# Altium schematic sheet wunfly.SchDoc
size A2
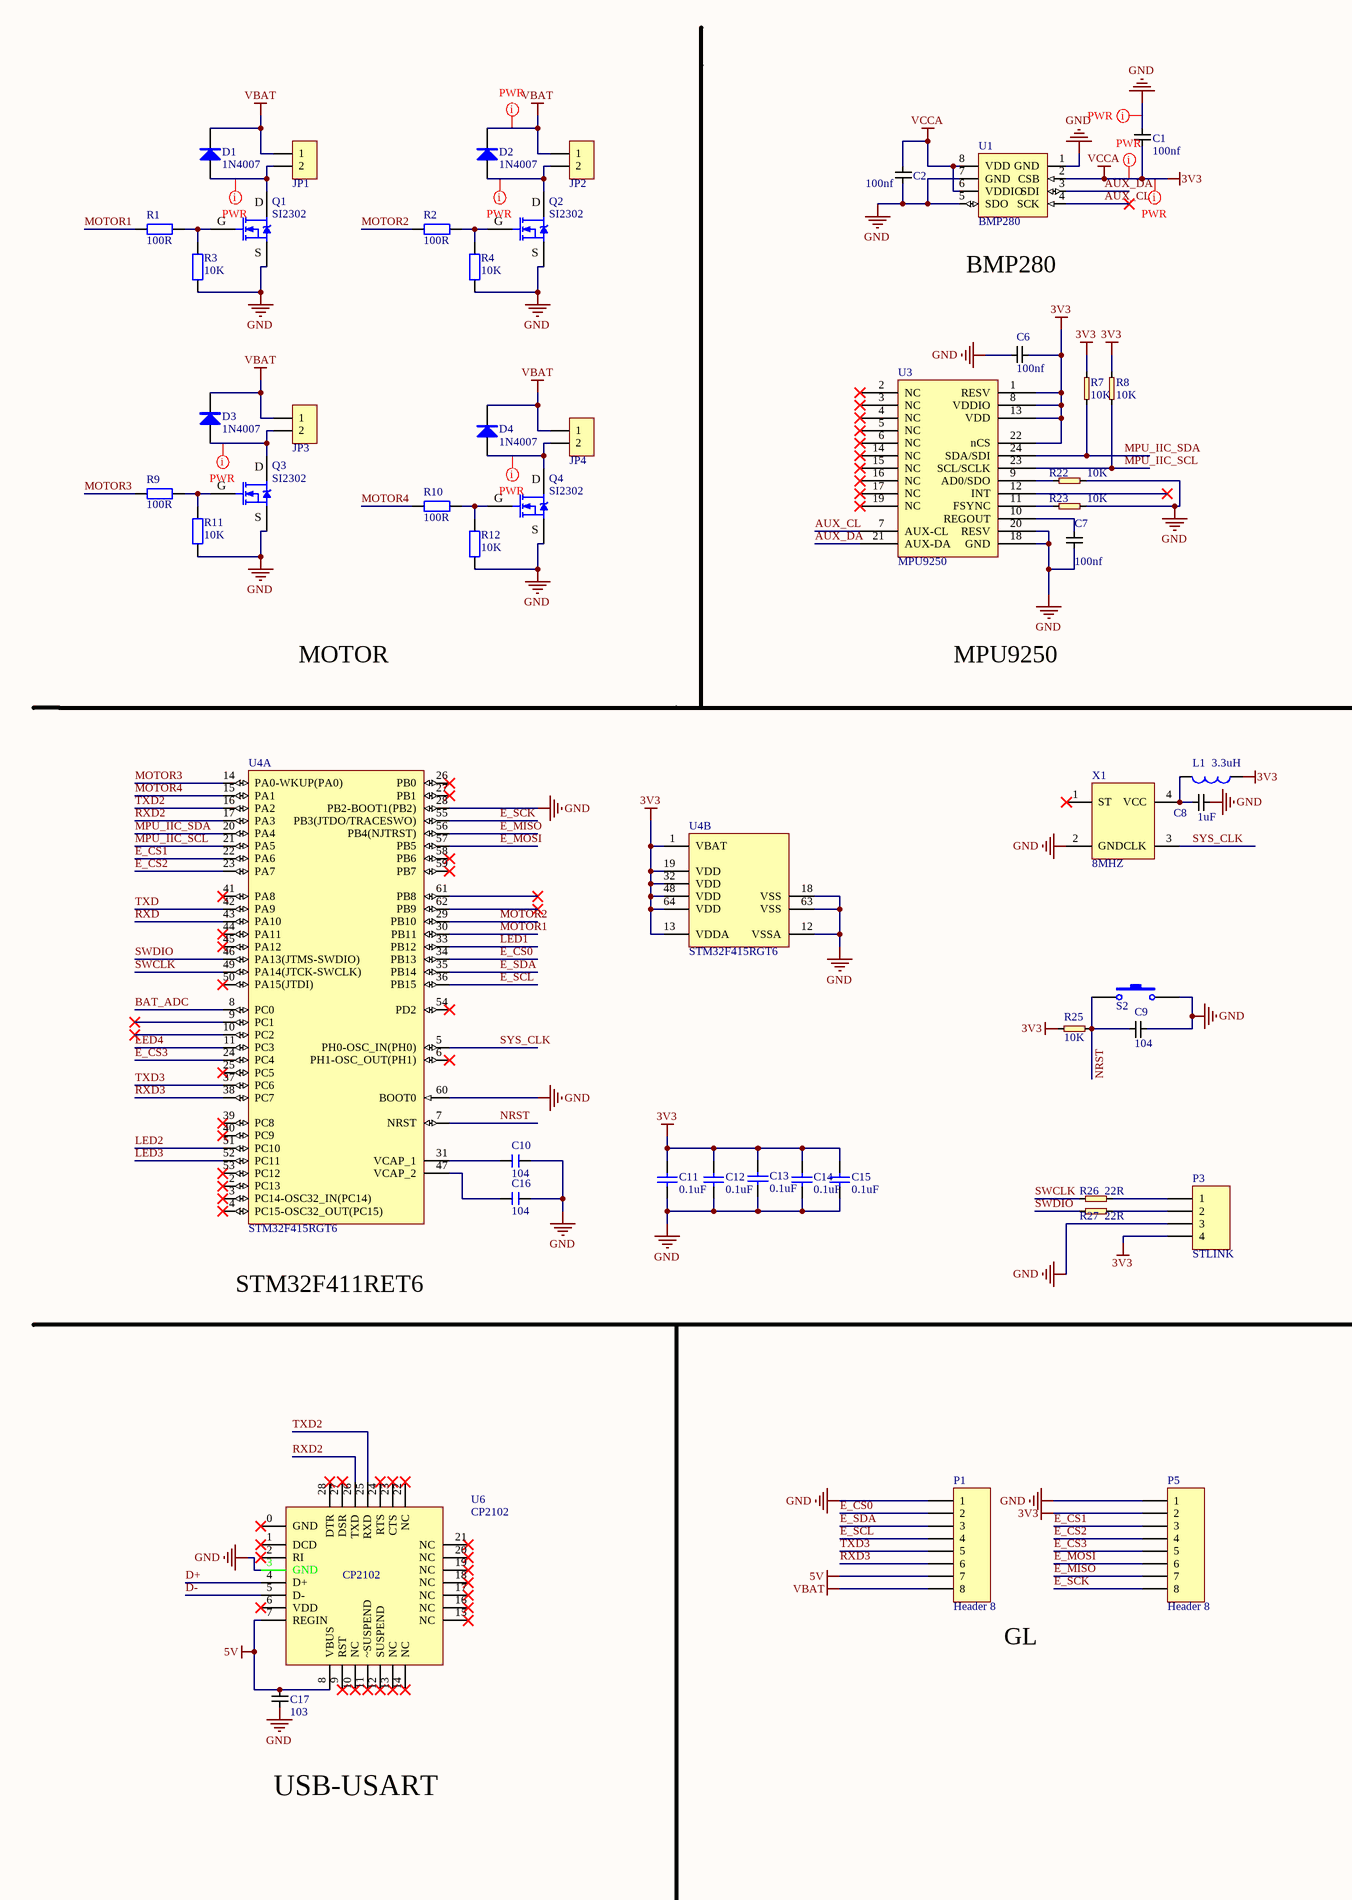
[diagram p0: wunfly.SchDoc, left]
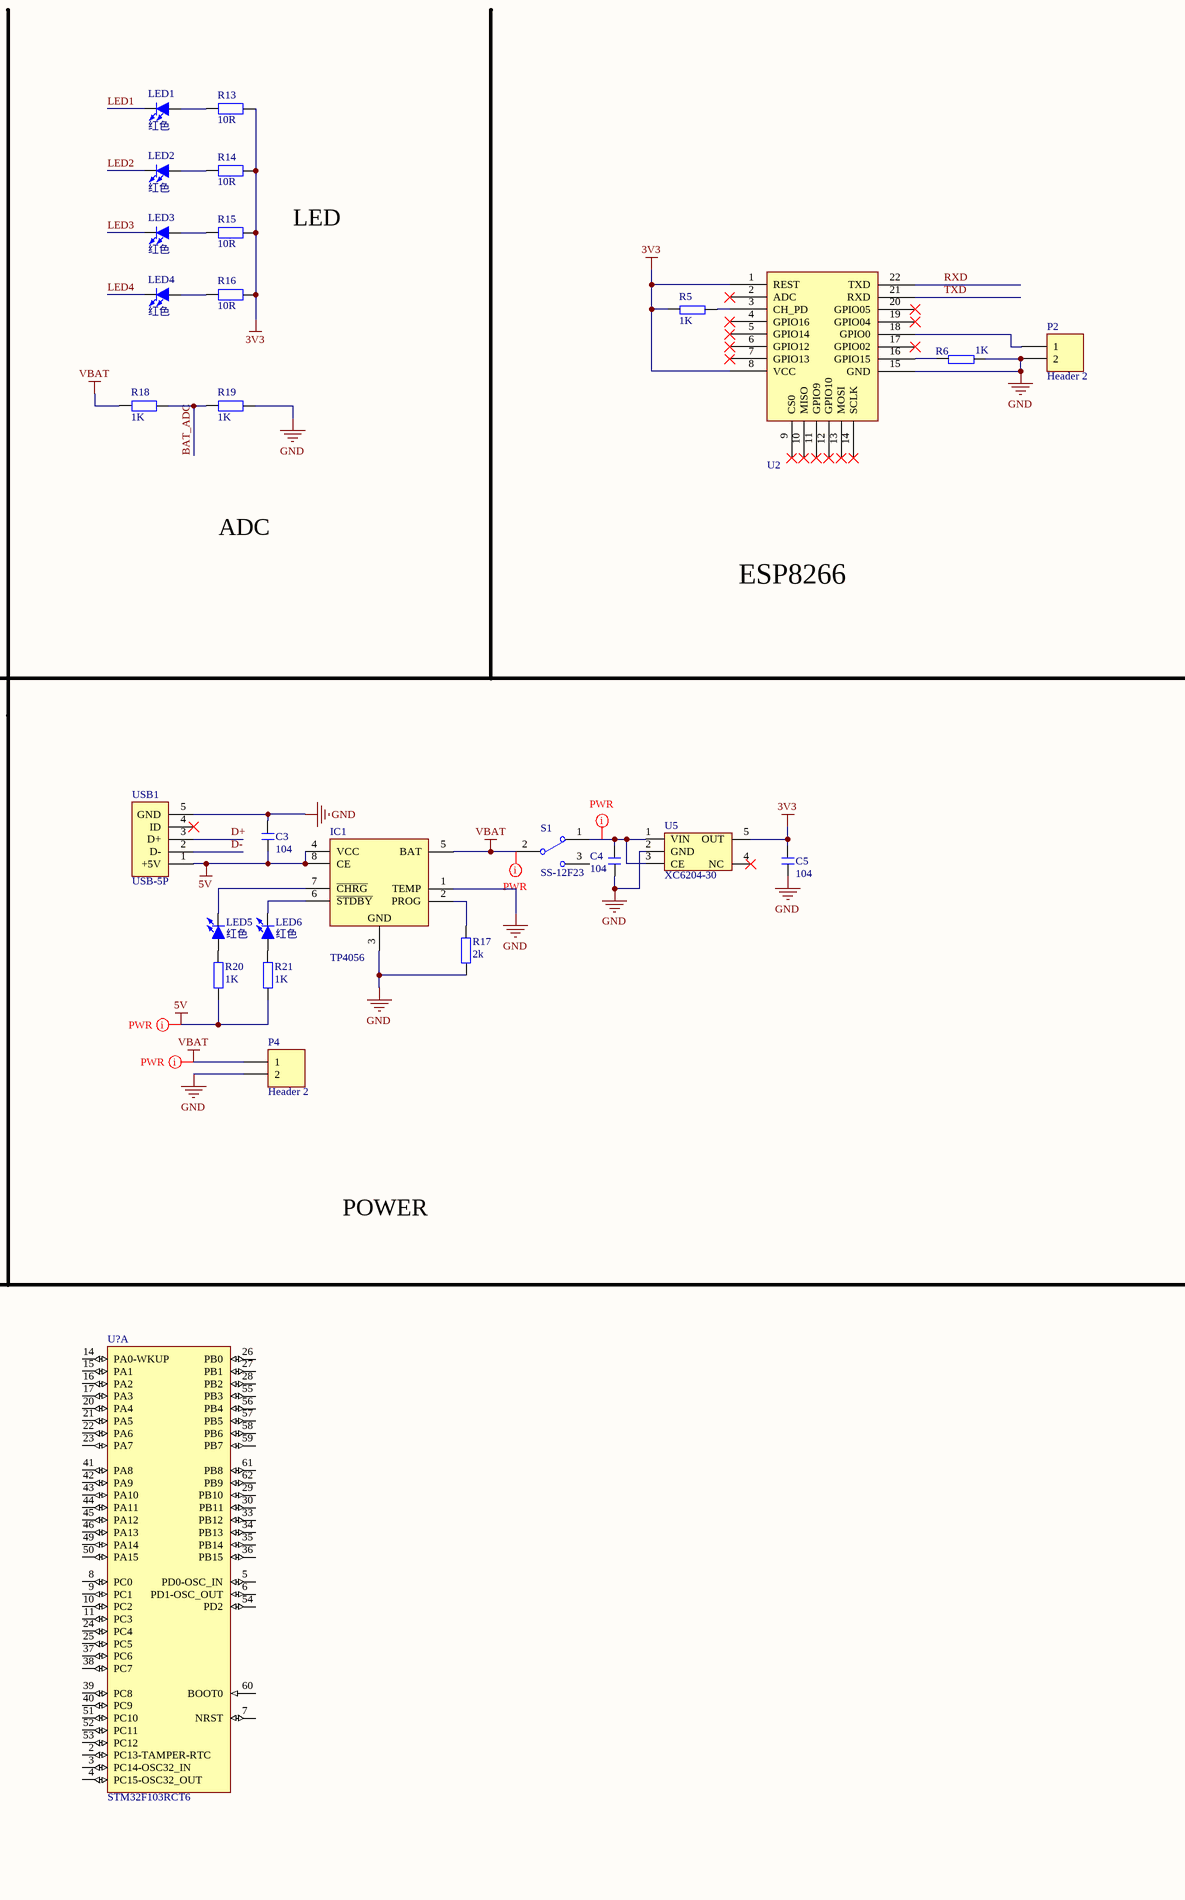
[diagram p1: wunfly.SchDoc, right]

## Parts
C1  100nf  [0603_C]
C2  100nf  [0603_C]
C3  104  [0603_C]
C4  104  [0603_C]
C5  104  [0603_C]
C6  100nf  [0603_C]
C7  100nf  [0603_C]
C8  1uF  [0603_C]
C9  104  [0603_C]
C10  104  [0603_C]
C11  0.1uF  [0603_C]
C12  0.1uF  [0603_C]
C13  0.1uF  [0603_C]
C14  0.1uF  [0603_C]
C15  0.1uF  [0603_C]
C16  104  [0603_C]
C17  103  [0603_C]
D1  1N4007  [SOD-123]
D2  1N4007  [SOD-123]
D3  1N4007  [SOD-123]
D4  1N4007  [SOD-123]
IC1  TP4056  [SOP8_N]
JP1  HDR-1X2  [XH2.54-WI-2P]  (value not drawn)
JP2  HDR-1X2  [XH2.54-WI-2P]  (value not drawn)
JP3  HDR-1X2  [XH2.54-WI-2P]  (value not drawn)
JP4  HDR-1X2  [XH2.54-WI-2P]  (value not drawn)
L1  3.3uH  [0603_R]
LED1  红色  [LED 0805G]
LED2  红色  [LED 0805G]
LED3  红色  [LED 0805G]
LED4  红色  [LED 0805G]
LED5  红色  [LED 0805G]
LED6  红色  [LED 0805G]
P1  Header 8  [HDR1X8]
P2  Header 2  [HDR1X2]
P3  STLINK  [HDR1X4]
P4  Header 2  [HDR1X2]
P5  Header 8  [HDR1X8]
Q1  SI2302  [SOT23-3N]
Q2  SI2302  [SOT23-3N]
Q3  SI2302  [SOT23-3N]
Q4  SI2302  [SOT23-3N]
R1  100R  [0603_R]
R2  100R  [0603_R]
R3  10K  [0603_R]
R4  10K  [0603_R]
R5  1K  [0603_R]
R6  1K  [0603_R]
R7  10K  [0603_R]
R8  10K  [0603_R]
R9  100R  [0603_R]
R10  100R  [0603_R]
R11  10K  [0603_R]
R12  10K  [0603_R]
R13  10R  [0603_R]
R14  10R  [0603_R]
R15  10R  [0603_R]
R16  10R  [0603_R]
R17  2k  [0603_R]
R18  1K  [0603_R]
R19  1K  [0603_R]
R20  1K  [0603_R]
R21  1K  [0603_R]
R22  10K  [0603_R]
R23  10K  [0603_R]
R25  10K  [0603_R]
R26  22R  [0603_R]
R27  22R  [0603_R]
S1  SS-12F23  [MSK-12C01-07]
S2  SW-PB  [SW-3625]  (value not drawn)
U1  BMP280  [LGA-8]
U2  ESP8266  [ESP-8266]  (value not drawn)
U3  MPU9250  [QFN24]
U4  STM32F415RGT6  [STM-LQFP64_N]  (parts A,B of 2)
U5  XC6204-30  [SOT-23-5]
U6  CP2102  [QFN-28]
U?  STM32F103RCT6  [STM-LQFP64_N]  (part A of 2)
USB1  USB-5P  [Micro_USB]
X1  8MHZ  [OSC]

## Nets
3V3: C1.1 C2.2 C5.2 C6.1 C11.2 C12.2 C13.2 C14.2 C15.2 L1.1 P3.4 P5.2 R5.1 R7.2 R8.2 R13.2 R14.2 R15.2 R16.2 R25.1 U1.2(CSB) U1.6(VDDIO) U1.8(VDD) U2.1(REST) U2.8(VCC) U3.1(RESV) U3.8(VDDIO) U3.13(VDD) U3.22(nCS) U4.1(VBAT) U4.13(VDDA) U4.19(VDD) U4.32(VDD) U4.48(VDD) U4.64(VDD) U5.5(OUT)  [also labelled VCCA]
5V: C3.1 C17.2 IC1.4(VCC) IC1.8(CE) P1.7 R20.1 R21.1 U6.7(REGIN) U6.8(VBUS) USB1.1(+5V)
GND: C1.2 C2.1 C3.2 C4.1 C5.1 C6.2 C7.1 C8.2 C9.2 C10.2 C11.1 C12.1 C13.1 C14.1 C15.1 C16.2 C17.1 IC1.1(TEMP) IC1.3(GND) P1.1 P2.2 P3.3 P4.2 P5.1 Q1.2(S) Q2.2(S) Q3.2(S) Q4.2(S) R3.1 R4.1 R6.2 R11.1 R12.1 R17.1 R19.2 R22.1 R23.1 S2.2 U1.1(GND) U1.5(SDO) U1.7(GND) U2.15(GND) U3.18(GND) U3.20(RESV) U4.12(VSSA) U4.18(VSS) U4.28(PB2-BOOT1(PB2)) U4.60(BOOT0) U4.63(VSS) U5.2(GND) U6.3(GND) USB1.5(GND) X1.2(GND)
VBAT: D1.2(K) D2.2(K) D3.2(K) D4.2(K) IC1.5(BAT) JP1.1 JP2.1 JP3.1 JP4.1 P1.8 P4.1 R18.1 S1.2
AUX_CL: U1.4(SCK) U3.7(AUX-CL)
AUX_DA: U1.3(SDI) U3.21(AUX-DA)
BAT_ADC: R18.2 R19.1 U4.8(PC0)
D+: U6.4(D+) USB1.3(D+)
D-: U6.5(D-) USB1.2(D-)
E_CS0: P1.2 U4.34(PB13)
E_CS1: P5.3 U4.22(PA6)
E_CS2: P5.4 U4.23(PA7)
E_CS3: P5.5 U4.24(PC4)
E_MISO: P5.7 U4.56(PB4(NJTRST))
E_MOSI: P5.6 U4.57(PB5)
E_SCK: P5.8 U4.55(PB3(JTDO/TRACESWO))
E_SCL: P1.4 U4.36(PB15)
E_SDA: P1.3 U4.35(PB14)
LED1: LED1.2(K) U4.33(PB12)
LED2: LED2.2(K) U4.51(PC10)
LED3: LED3.2(K) U4.52(PC11)
LED4: LED4.2(K) U4.11(PC3)
MOTOR1: R1.1 U4.30(PB11)
MOTOR2: R2.1 U4.29(PB10)
MOTOR3: R9.1 U4.14(PA0-WKUP(PA0))
MOTOR4: R10.1 U4.15(PA1)
MPU_IIC_SCL: R8.1 U3.23(SCL/SCLK) U4.21(PA5)
MPU_IIC_SDA: R7.1 U3.24(SDA/SDI) U4.20(PA4)
NRST: C9.1 R25.2 S2.1 U4.7(NRST)
RXD: U2.22(TXD) U4.43(PA10)
RXD2: U4.17(PA3) U6.26(TXD)
RXD3: P1.6 U4.38(PC7)
SWCLK: R26.1 U4.49(PA14(JTCK-SWCLK))
SWDIO: R27.1 U4.46(PA13(JTMS-SWDIO))
SYS_CLK: U4.5(PH0-OSC_IN(PH0)) X1.3(CLK)
TXD: U2.21(RXD) U4.42(PA9)
TXD2: U4.16(PA2) U6.25(RXD)
TXD3: P1.5 U4.37(PC6)
NetC4_2: C4.2 S1.1 U5.1(VIN) U5.3(CE)
NetC7_2: C7.2 U3.10(REGOUT)
NetC8_1: C8.1 L1.2 X1.4(VCC)
NetC10_1: C10.1 U4.31(VCAP_1)
NetC16_1: C16.1 U4.47(VCAP_2)
NetD1_1: D1.1(A) JP1.2 Q1.3(D)
NetD2_1: D2.1(A) JP2.2 Q2.3(D)
NetD3_1: D3.1(A) JP3.2 Q3.3(D)
NetD4_1: D4.1(A) JP4.2 Q4.3(D)
NetIC1_2: IC1.2(PROG) R17.2
NetIC1_6: IC1.6(~{STDBY}) LED6.2(K)
NetIC1_7: IC1.7(~{CHRG}) LED5.2(K)
NetLED1_1: LED1.1(A) R13.1
NetLED2_1: LED2.1(A) R14.1
NetLED3_1: LED3.1(A) R15.1
NetLED4_1: LED4.1(A) R16.1
NetLED5_1: LED5.1(A) R20.2
NetLED6_1: LED6.1(A) R21.2
NetP2_1: P2.1 U2.18(GPIO0)
NetP3_1: P3.1 R26.2
NetP3_2: P3.2 R27.2
NetQ1_1: Q1.1(G) R1.2 R3.2
NetQ2_1: Q2.1(G) R2.2 R4.2
NetQ3_1: Q3.1(G) R9.2 R11.2
NetQ4_1: Q4.1(G) R10.2 R12.2
NetR5_2: R5.2 U2.3(CH_PD)
NetR6_1: R6.1 U2.16(GPIO15)
NetR22_2: R22.2 U3.9(AD0/SDO)
NetR23_2: R23.2 U3.11(FSYNC)

Not connected (* = marked no-connect by the designer): S1 3; U2 2(ADC)* 4(GPIO16)* 5(GPIO14)* 6(GPIO12)* 7(GPIO13)* 9(CS0)* 10(MISO)* 11(GPIO9)* 12(GPIO10)* 13(MOSI)* 14(SCLK)* 17(GPIO02)* 19(GPIO04)* 20(GPIO05)*; U3 2(NC)* 3(NC)* 4(NC)* 5(NC)* 6(NC)* 12(INT)* 14(NC)* 15(NC)* 16(NC)* 17(NC)* 19(NC)*; U4 2(PC13)* 3(PC14-OSC32_IN(PC14))* 4(PC15-OSC32_OUT(PC15))* 6(PH1-OSC_OUT(PH1))* 9(PC1)* 10(PC2)* 25(PC5)* 26(PB0)* 27(PB1)* 39(PC8)* 40(PC9)* 41(PA8)* 44(PA11)* 45(PA12)* 50(PA15(JTDI))* 53(PC12)* 54(PD2)* 58(PB6)* 59(PB7)* 61(PB8)* 62(PB9)*; U5 4(NC)*; U6 0(GND)* 1(DCD)* 2(RI)* 6(VDD)* 9(RST)* 10(NC)* 11(~SUSPEND)* 12(SUSPEND)* 13(NC)* 14(NC)* 15(NC)* 16(NC)* 17(NC)* 18(NC)* 19(NC)* 20(NC)* 21(NC)* 22(NC)* 23(CTS)* 24(RTS)* 27(DSR)* 28(DTR)*; U? 2(PC13-TAMPER-RTC) 3(PC14-OSC32_IN) 4(PC15-OSC32_OUT) 5(PD0-OSC_IN) 6(PD1-OSC_OUT) 7(NRST) 8(PC0) 9(PC1) 10(PC2) 11(PC3) 14(PA0-WKUP) 15(PA1) 16(PA2) 17(PA3) 20(PA4) 21(PA5) 22(PA6) 23(PA7) 24(PC4) 25(PC5) 26(PB0) 27(PB1) 28(PB2) 29(PB10) 30(PB11) 33(PB12) 34(PB13) 35(PB14) 36(PB15) 37(PC6) 38(PC7) 39(PC8) 40(PC9) 41(PA8) 42(PA9) 43(PA10) 44(PA11) 45(PA12) 46(PA13) 49(PA14) 50(PA15) 51(PC10) 52(PC11) 53(PC12) 54(PD2) 55(PB3) 56(PB4) 57(PB5) 58(PB6) 59(PB7) 60(BOOT0) 61(PB8) 62(PB9); USB1 4(ID)*; X1 1(ST)*

## Layout directives
net class PWR: 3V3, 5V, GND, NetC4_2, NetD1_1, NetD2_1, NetD3_1, NetD4_1, VBAT

## Notes on the sheet
- BMP280
- LED
- ADC
- MOTOR
- MPU9250
- ESP8266
- STM32F411RET6
- POWER
- GL
- USB-USART

## Library data of the parts
C1 C2 C6-C9 C17 = C
C3-C5 C10 C16 = C: 无极性贴片电容; 版权归属: 源创客; BOM名称: 无极性贴片电容; 学习资源: www.ooocke.com
C11-C15 = Cap1: value: 0.1uF
D1-D4 = 1N4007: 整流二极管; 版权归属: 源创客; BOM名称: 整流二极管; 学习资源: www.ooocke.com
IC1 = TP4056: 锂电池充电管理; 版权归属: 源创客; BOM名称: 锂电池充电管理; 学习资源: www.ooocke.com
JP1-JP4 = Header 2: 2P接插件; 版权归属: 源创客; BOM名称: 2P接插件; 学习资源: www.ooocke.com
L1 = Inductor
LED1-LED6 = LED-SMD: 贴片LED; 版权归属: 源创客; BOM名称: 贴片LED; 学习资源: www.ooocke.com
P1 P5 = Header 8: Header, 8-Pin; LatestRevisionDate: 17-Jul-2002; LatestRevisionNote: Re-released for DXP Platform.; Publisher: Altium Limited
P2 P4 = Header 2: Header, 2-Pin; LatestRevisionDate: 17-Jul-2002; LatestRevisionNote: Re-released for DXP Platform.; Publisher: Altium Limited
P3 = Header 4: Header, 4-Pin; LatestRevisionDate: 17-Jul-2002; LatestRevisionNote: Re-released for DXP Platform.; Publisher: Altium Limited
Q1-Q4 = SI2302: N沟道场效应管; 版权归属: 源创客; BOM名称: N沟道场效应管; 学习资源: www.ooocke.com
R1-R4 R9-R21 = R: 贴片电阻; 版权归属: 源创客; BOM名称: 贴片电阻; 学习资源: www.ooocke.com
R5-R8 R22 R23 R25-R27 = R
S1 = SSW-1P: 1路波动开关; BOM名称: 波动开关; 版权归属: 源创客; 学习资源: www.ooocke.com
U4 = STM32F415RGT6: ARM Cortex-M4 32-bit MCU+FPU, 210 DMIPS, 1024 kB Flash, 192 kB Internal RAM, 51 I/Os, 64-pin LQFP, -40 to 85 degC, Tray; Manufacturer: STMicroelectronics; D/A Converter: 2x12-bit; FLASH Size (Prog) (kB): 1024; I/Os (High Current): 51; Internal RAM Size (kB): 192; Operating Frequency(F) (Processor speed) (MHz): 168; Supply Voltage(Vcc) max (V): 3.6; Supply Voltage(Vcc) min (V): 1.8; DatasheetVersion: Rev. 4; PackageVersion: Rev. 4, 06/2013; PackageReference: LQFP64; PackageDescription: 64-Pin Low Profile Quad Flat Package, 10 x 10 mm Body, 0.5 mm Pitch; Supplier 1: Digi-Key; Supplier Part Number 1: 497-11907-ND; Supplier 2: Farnell; Supplier Part Number 2: 2064370; Supplier 3: Newark; Supplier Part Number 3: 73T2335; Supplier 4: Mouser; Supplier Part Number 4: 511-STM32F415RGT6; Core: ARM Cortex-M4; Packing: Tray; Mounting Technology: Surface Mount; PartNumber: STM32F415RGT6; ComponentLink1Description: Manufacturer URL; ComponentLink1URL: http://www.st.com/web/en/home.html; ComponentLink2Description: Datasheet; ComponentLink2URL: http://www.st.com/st-web-ui/static/active/en/resource/technical/document/datasheet/DM00035129.pdf; ComponentLink3Description: Package Specification; ComponentLink3URL: http://www.st.com/st-web-ui/static/active/en/resource/technical/document/datasheet/DM00037051.pdf
U5 = XC6204
U? = STM32F103RCT6: ARM Cortex-M3 32-bit MCU, 256 KB Flash, 48 KB Internal RAM, 51 I/Os, 64-pin LQFP, -40 to 85 degC, Tray; A/D Converter: 3x12-bit (16 Channel); D/A Converter: 2x12-bit (2 Channel); FLASH Size (Prog) (kB): 256; I/Os (High Current): 51; Internal RAM Size (kB): 48; Operating Frequency(F) (Processor speed) (MHz): 72; Supply Voltage(Vcc) min (V): 2; DatasheetVersion: Rev. 8; PackageVersion: Rev. 4, 06/2013; PackageReference: LQFP64; PackageDescription: 64-Pin Low Profile Quad Flat Package, 10 x 10 mm Body, 0.5 mm Pitch; Supplier 1: Digi-Key; Supplier Part Number 1: 497-9033-ND; Supplier 2: Newark; Supplier Part Number 2: 01P4099; Supplier 3: Newark; Supplier Part Number 3: 57P1227; Supplier 4: Mouser; Supplier Part Number 4: 511-STM32F103RCT6; Core: ARM Cortex-M3; Packing: Tray; Mounting Technology: Surface Mount; PartNumber: STM32F103RCT6; ComponentLink1Description: Manufacturer URL; ComponentLink1URL: http://www.st.com/web/en/home.html; ComponentLink2Description: Datasheet; ComponentLink2URL: http://www.st.com/st-web-ui/static/active/en/resource/technical/document/datasheet/CD00191185.pdf; ComponentLink3Description: Package Specification; ComponentLink3URL: http://www.st.com/st-web-ui/static/active/en/resource/technical/document/datasheet/DM00037051.pdf
USB1 = USB-5P: 微型USB母座; 版权归属: 源创客; BOM名称: 微型USB母座; 学习资源: www.ooocke.com
X1 = OSC